# Altium schematic sheet Phase 4.SchDoc (part 4 of 4)
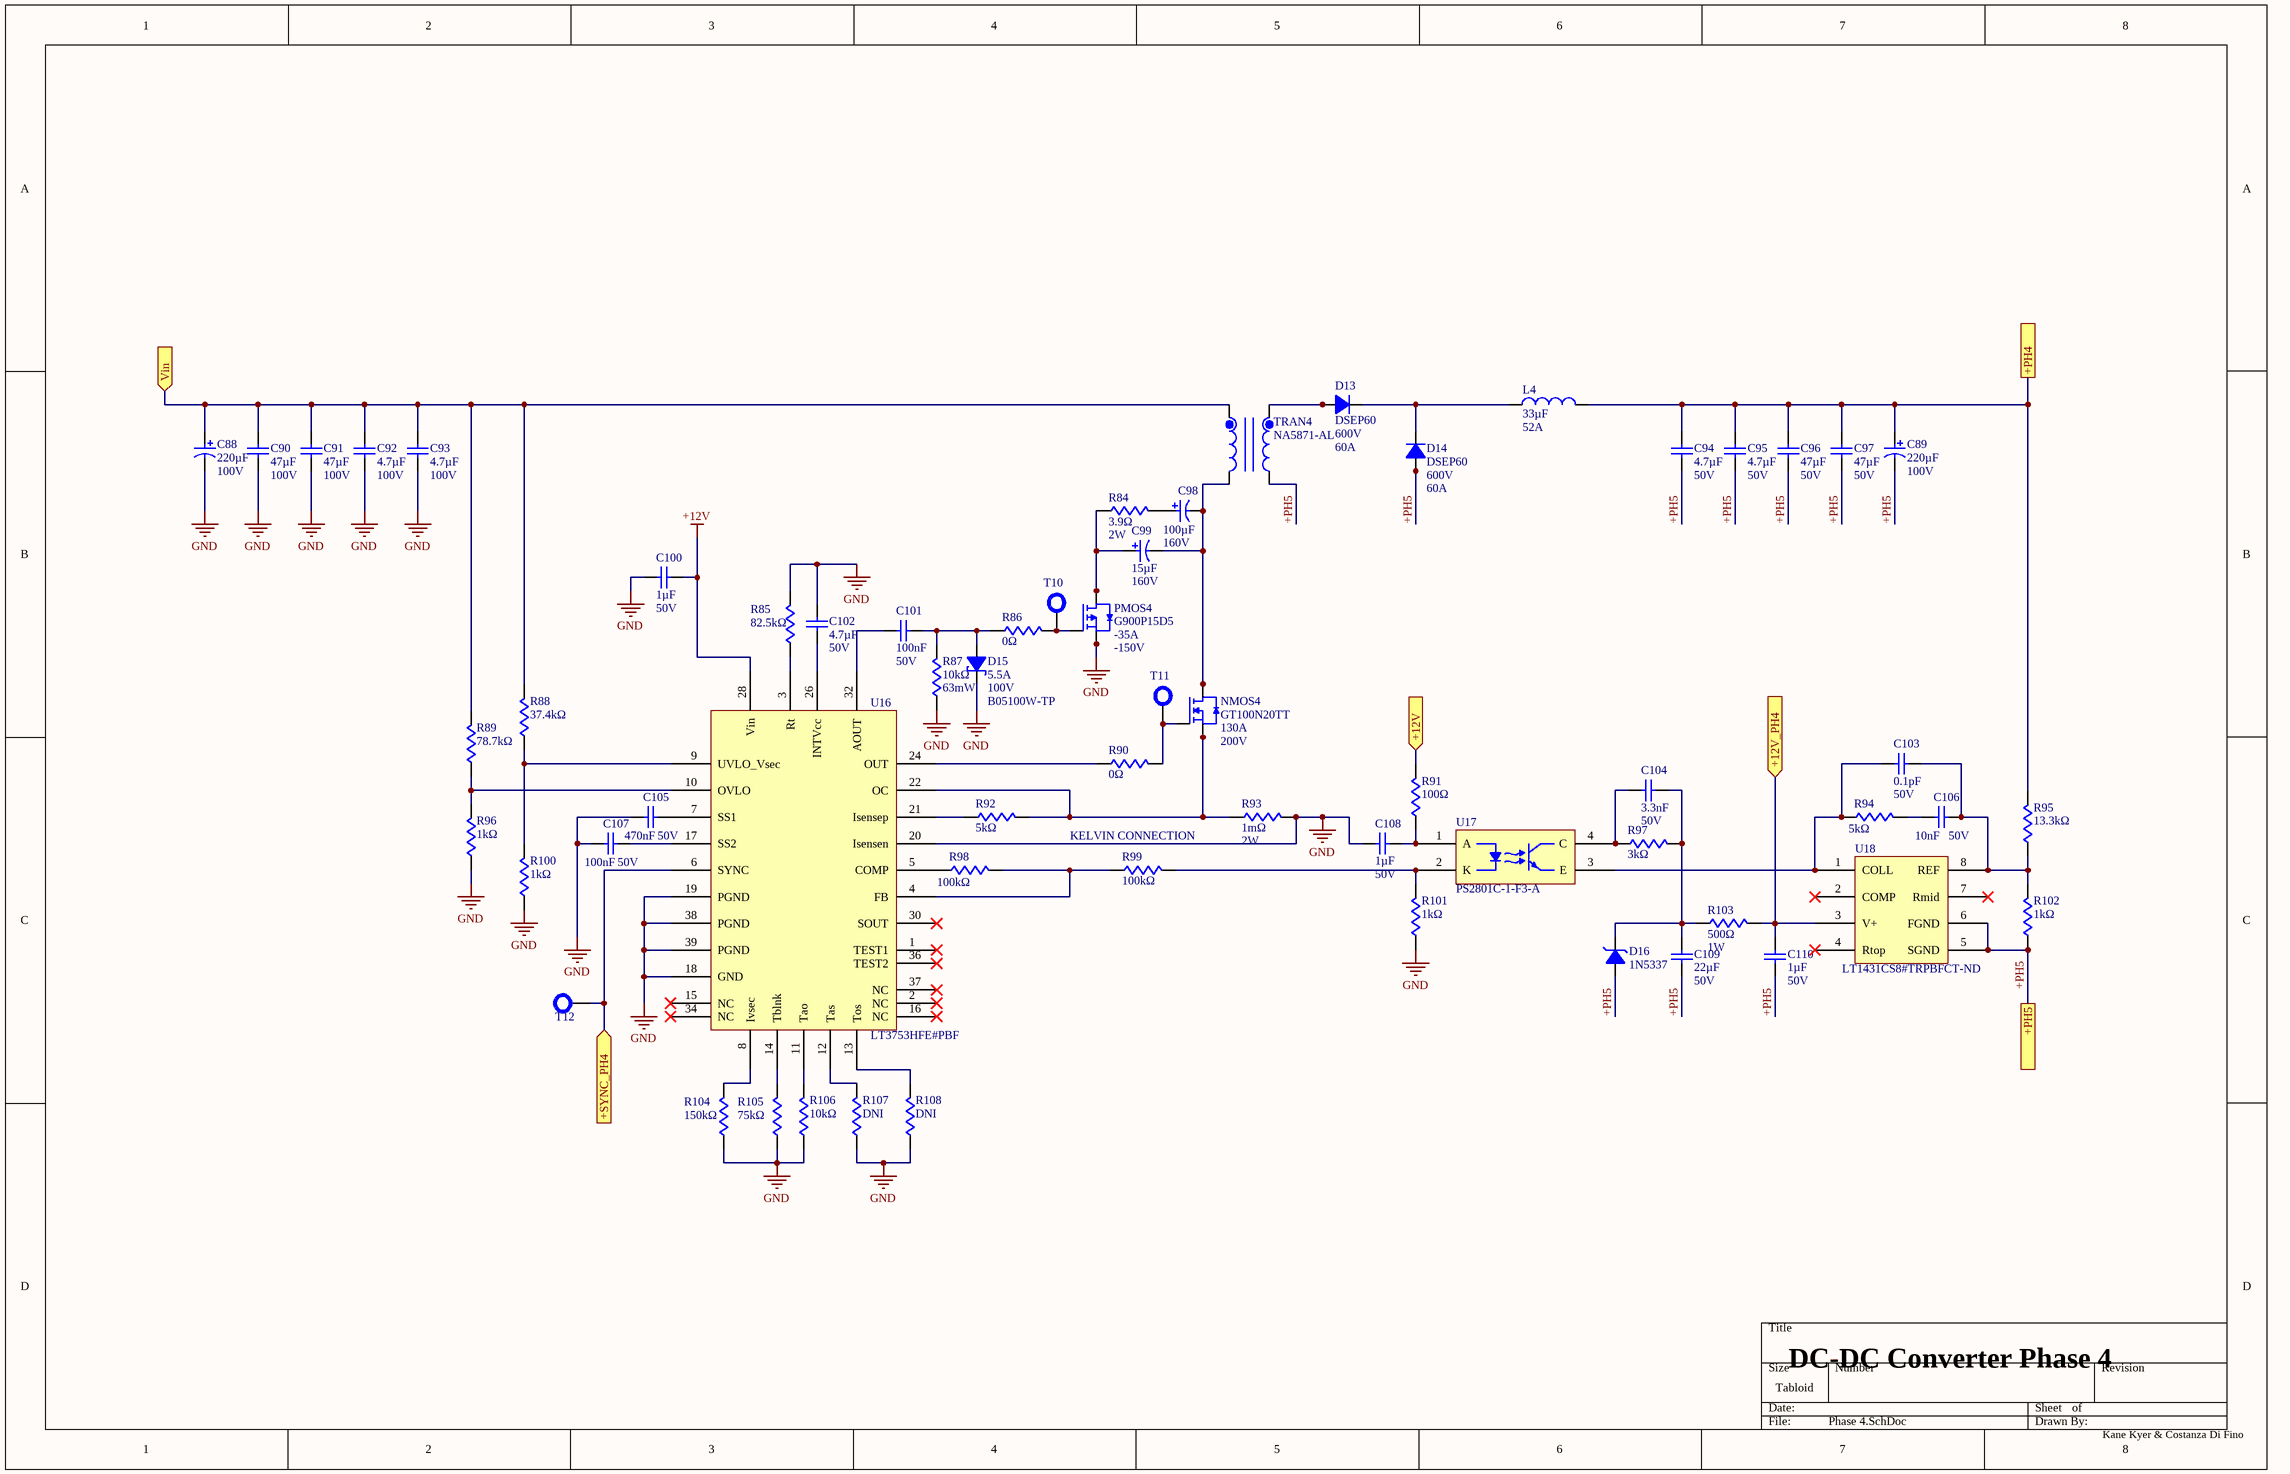
[diagram p3: Phase 4.SchDoc]

## Library data of the parts (continued)
U16 = LT3753HFE#PBF: 500kHz 8.5V~100V Buck-boost type 1 TSSOP-38-EP-4.4mm DC-DC Controllers ROHS; Manufacturer: Analog Devices; Manufacturer Lifecycle Status: PRODUCTION; Clock Sync: Yes; Max Supply Voltage: 100V; Min Supply Voltage: 8.5V; Nominal Supply Voltage: 12V; Number of Output Phases: 1; Topology: Forward Converter; Supplier: DigiKey; Supplier Part Number: LT3753HFE#PBF-ND; Manufacturer Part Number: LT3753HFE#PBF; RoHS: Compliant; Category: Power Management ICs; Stock: 4347; Pricing: 1=10.29, 10=8.033, 50=7.1302, 100=6.8507, 250=6.55552, 500=6.37764, 1000=6.23122 (USD); Case/Package: TSSOP; Frequency: 500kHz; Lifecycle Status: Production; Max Operating Temperature: 150°C; Min Operating Temperature: -40°C; Number of Outputs: 1; Pins: 31; Packaging: Cut Tape; REACH SVHC: No; Switching Frequency: 500kHz; Synchronous Rectifier: Yes; ComponentLink1URL: https://octopart.com:443/opatz8j6/c1?t=AFQ9J6M0bIKkv6plnB5aAB0RnePbyXhKQsa9pPFhZHIxlwYjryM3wnKOLEsPVrUAb0uXBMlzA3tjB-ejWwJKA7_cYNCdDBFeGPchwLcL7lXLjnUlKv0pBKfNuCEAZb8jTxRmFbxH9_jiNX6SVIrk2iwMUDb85Rbf6FC_21WJLsegI-Zm9eDxKUbvdxMUJlwEOrU3PsP6IHDcoU8HT-gJ-IT5i33qvtZm8K-bNX2Lqntbu9Y54Ggik3dFc7AlQv41q86evmeQPql3FfxnQIXi9zZ77tUgOd_x3vIhB6dB6_NjHFvgfISRLA&src-supplier=Analog+Devices; ComponentLink1Description: https://octopart.com:443/opatz8j6/c1?t=AFQ9J6M0bIKkv6plnB5aAB0RnePbyXhKQsa9pPFhZHIxlwYjryM3wnKOLEsPVrUAb0uXBMlzA3tjB-ejWwJKA7_cYNCdDBFeGPchwLcL7lXLjnUlKv0pBKfNuCEAZb8jTxRmFbxH9_jiNX6SVIrk2iwMUDb85Rbf6FC_21WJLsegI-Zm9eDxKUbvdxMUJlwEOrU3PsP6IHDcoU8HT-gJ-IT5i33qvtZm8K-bNX2Lqntbu9Y54Ggik3dFc7AlQv41q86evmeQPql3FfxnQIXi9zZ77tUgOd_x3vIhB6dB6_NjHFvgfISRLA&src-supplier=Analog+Devices; ComponentLink2URL: https://datasheet.octopart.com:443/LT3753HFE%23PBF-Analog-Devices-datasheet-48576317.pdf?src-supplier=Farnell; ComponentLink2Description: https://datasheet.octopart.com:443/LT3753HFE%23PBF-Analog-Devices-datasheet-48576317.pdf?src-supplier=Farnell; ComponentLink3URL: https://datasheet.octopart.com:443/LT3753HFE%23PBF-Linear-Technology-datasheet-27844002.pdf?src-supplier=Newark; ComponentLink3Description: https://datasheet.octopart.com:443/LT3753HFE%23PBF-Linear-Technology-datasheet-27844002.pdf?src-supplier=Newark; ComponentLink4URL: https://sigma.octopart.com:443/57697520/technical_drawing/Linear-Technology-LT3753HFE%23PBF.pdf?src-supplier=Linear+Technology; ComponentLink4Description: https://sigma.octopart.com:443/57697520/technical_drawing/Linear-Technology-LT3753HFE%23PBF.pdf?src-supplier=Linear+Technology; ComponentLink5URL: http://sigma.octopart.com:80/conflict_mineral_statement/Analog-Devices-company-33.pdf?src-supplier=Compliance+Statements; ComponentLink5Description: http://sigma.octopart.com:80/conflict_mineral_statement/Analog-Devices-company-33.pdf?src-supplier=Compliance+Statements; ComponentLink6URL: https://octopart.com:443/opatz8j6/c1?t=KpEjZENBkZ1-NUw-HjtedR9eLFJgymQ7GAK9rV5XKw3SqyDfJALBEApSMAE4CIdvoIQE0qP2K0XqaVt1GtZBag8rPx6zoXdBMr-uXqEdbgEjspU48heZgw1UTAaO9ifIt2F3aJLStdwEWxdJfmrN_EKcrP--VivhMJ7qdoeOV73bwFAQ1EnOK3cSuydEiXau78N9Bo3Gx89sRxnpMKkn9KAIUgYVAzwMH423vtfKzU2i8agEMc24Yn4z-4hMRrlXjpe_N-iOuMEGnC_qTiMDsYzo8HjdXEF1YpfTJcfYnFjkdZay3x1sag&src-supplier=Compliance+Statements; ComponentLink6Description: https://octopart.com:443/opatz8j6/c1?t=KpEjZENBkZ1-NUw-HjtedR9eLFJgymQ7GAK9rV5XKw3SqyDfJALBEApSMAE4CIdvoIQE0qP2K0XqaVt1GtZBag8rPx6zoXdBMr-uXqEdbgEjspU48heZgw1UTAaO9ifIt2F3aJLStdwEWxdJfmrN_EKcrP--VivhMJ7qdoeOV73bwFAQ1EnOK3cSuydEiXau78N9Bo3Gx89sRxnpMKkn9KAIUgYVAzwMH423vtfKzU2i8agEMc24Yn4z-4hMRrlXjpe_N-iOuMEGnC_qTiMDsYzo8HjdXEF1YpfTJcfYnFjkdZay3x1sag&src-supplier=Compliance+Statements
U17 = PS2801C-1-F3-A: Optocoupler DC-IN 1-CH Transistor DC-OUT 4-Pin SSOP T/R; Manufacturer: Renesas; Manufacturer Lifecycle Status: ACTIVE; Collector Emitter Breakdown Voltage: 80V; Collector Emitter Saturation Voltage: 300mV; Current Transfer Ratio: 50%; Dark Current: 100nA; Forward Current: 30mA; Forward Voltage: 1.4V; Input Current: 5mA; Isolation Voltage: 2.5kV; Max Power Dissipation: 120mW; Number of Elements: 1; Reverse Breakdown Voltage: 6V; Target Application: PLC\, Hybrid IC\, Power supply\, OA\, Measuring instrument\, Modem\, Communication devices; Supplier: DigiKey; RoHS: Compliant; Category: Optocouplers; Stock: 8089; Pricing: 1=0.85, 10=0.594, 100=0.436, 500=0.3653, 1000=0.34213 (USD); Case/Package: SSOP; China RoHS: Compliant; Collector Emitter Voltage (VCEO): 80V; Contact Plating: Tin Bismuth; Export Control Classification Number (ECCN) Code: EAR99; Part Family: PS2801C-1; Height: 2.1mm; Harmonized Tariff Schedule (HTS) Code: 8541.49.8000; Lifecycle Status: Production; Max Operating Temperature: 100°C; Min Operating Temperature: -55°C; MSL: 1; Mounting Technology: Surface Mount; Pins: 4; Output Voltage: 80V; Packaging: Cut Tape; REACH SVHC: Yes; ComponentLink1URL: https://datasheet.octopart.com:443/PS2801C-1-F3-A-Renesas-datasheet-179197394.pdf?src-supplier=Integrated+Device+Technology; ComponentLink1Description: https://datasheet.octopart.com:443/PS2801C-1-F3-A-Renesas-datasheet-179197394.pdf?src-supplier=Integrated+Device+Technology; ComponentLink2URL: https://datasheet.octopart.com:443/PS2801C-1-F3-A-Renesas-datasheet-150850810.pdf?src-supplier=Integrated+Device+Technology; ComponentLink2Description: https://datasheet.octopart.com:443/PS2801C-1-F3-A-Renesas-datasheet-150850810.pdf?src-supplier=Integrated+Device+Technology; ComponentLink3URL: https://datasheet.octopart.com:443/PS2801C-1-F3-A-Integrated-Device-Technology-datasheet-149188203.pdf?src-supplier=Integrated+Device+Technology; ComponentLink3Description: https://datasheet.octopart.com:443/PS2801C-1-F3-A-Integrated-Device-Technology-datasheet-149188203.pdf?src-supplier=Integrated+Device+Technology; ComponentLink4URL: https://datasheet.octopart.com:443/PS2801C-1-F3-A-Renesas-datasheet-181196928.pdf?src-supplier=IHS; ComponentLink4Description: https://datasheet.octopart.com:443/PS2801C-1-F3-A-Renesas-datasheet-181196928.pdf?src-supplier=IHS; ComponentLink5URL: https://datasheet.octopart.com:443/PS2801C-1-F3-A-NEC-datasheet-180895691.pdf?src-supplier=IHS; ComponentLink5Description: https://datasheet.octopart.com:443/PS2801C-1-F3-A-NEC-datasheet-180895691.pdf?src-supplier=IHS; ComponentLink6URL: https://datasheet.octopart.com:443/PS2801C-1-F3-A-Renesas-datasheet-138175760.pdf?src-supplier=Renesas; ComponentLink6Description: https://datasheet.octopart.com:443/PS2801C-1-F3-A-Renesas-datasheet-138175760.pdf?src-supplier=Renesas; ComponentLink7URL: https://datasheet.octopart.com:443/PS2801C-1-F3-A-Renesas-datasheet-5346041.pdf?src-supplier=element14+APAC; ComponentLink7Description: https://datasheet.octopart.com:443/PS2801C-1-F3-A-Renesas-datasheet-5346041.pdf?src-supplier=element14+APAC; ComponentLink8URL: https://datasheet.octopart.com:443/PS2801C-1-F3-A-Renesas-datasheet-136880012.pdf?src-supplier=Future+Electronics; ComponentLink8Description: https://datasheet.octopart.com:443/PS2801C-1-F3-A-Renesas-datasheet-136880012.pdf?src-supplier=Future+Electronics; ComponentLink9URL: http://sigma.octopart.com:80/reach_statement/Renesas-company-45.pdf?src-supplier=Compliance+Statements; ComponentLink9Description: http://sigma.octopart.com:80/reach_statement/Renesas-company-45.pdf?src-supplier=Compliance+Statements; ComponentLink10URL: http://sigma.octopart.com:80/conflict_mineral_statement/Renesas-company-44.pdf?src-supplier=Compliance+Statements; ComponentLink10Description: http://sigma.octopart.com:80/conflict_mineral_statement/Renesas-company-44.pdf?src-supplier=Compliance+Statements; Supplier Part Number: 559-1038-1-ND; Manufacturer Part Number: PS2801C-1-F3-A
U18 = LT1431CS8#TRPBF: V-Ref Adjustable 2.5V to 36V 100mA 8-Pin SOIC N T/R; Manufacturer: Analog Devices; Manufacturer Lifecycle Status: PRODUCTION; Cathode Current: 1mA; Reference Type: Shunt; Temperature Coefficient: 30ppm/°C; Tolerance: 0.4%; Supplier: DigiKey; Manufacturer Part Number: LT1431CS8#TRPBF; RoHS: Compliant; Category: Voltage References; Stock: 6692; Pricing: 1=4.76, 10=3.623, 25=3.3384, 100=3.025, 250=2.9682 (USD); Lead Free: Lead Free; Lifecycle Status: Production; Max Operating Temperature: 70°C; Max Output Voltage: 36V; Min Operating Temperature: 0°C; Min Output Voltage: 2.5V; Mounting Technology: Surface Mount; Pins: 8; Output Current: 100mA; Output Type: Adjustable; ComponentLink1URL: https://octopart.com:443/opatz8j6/c1?t=niELlFxzDfi0yCwovPYUCPkFv5h4fu5j3fc6Y_JWgZS-KG3gguwV1nhos1IG-X0q8FOT95_5suT6z4bIqEEHZa5Cr0Tl4wX-4Gea3le2l_P5Btni36aNB0VKN1eACfVw6XjlixpjNPZ2EoCnIZsmdjVtLb4T5dOKJqdmaG9p1s8rLUbRPnop80aw4yYD8dobzP2rtKjoPZxkMFX7s_x1MbrDISVlTufhy0OqU5fodmlGcRlmdB2uK6Q8wi9wAMnylkp3u30aJUXp9y1pTV4VT8brQ8AQsJucKiRghXvlz7QI_mNVRP68og&src-supplier=Analog+Devices; ComponentLink1Description: https://octopart.com:443/opatz8j6/c1?t=niELlFxzDfi0yCwovPYUCPkFv5h4fu5j3fc6Y_JWgZS-KG3gguwV1nhos1IG-X0q8FOT95_5suT6z4bIqEEHZa5Cr0Tl4wX-4Gea3le2l_P5Btni36aNB0VKN1eACfVw6XjlixpjNPZ2EoCnIZsmdjVtLb4T5dOKJqdmaG9p1s8rLUbRPnop80aw4yYD8dobzP2rtKjoPZxkMFX7s_x1MbrDISVlTufhy0OqU5fodmlGcRlmdB2uK6Q8wi9wAMnylkp3u30aJUXp9y1pTV4VT8brQ8AQsJucKiRghXvlz7QI_mNVRP68og&src-supplier=Analog+Devices; ComponentLink2URL: https://datasheet.octopart.com:443/LT1431CS8%23TRPBF-Analog-Devices-datasheet-158590489.pdf?src-supplier=Augswan; ComponentLink2Description: https://datasheet.octopart.com:443/LT1431CS8%23TRPBF-Analog-Devices-datasheet-158590489.pdf?src-supplier=Augswan; ComponentLink3URL: https://sigma.octopart.com:443/57689574/technical_drawing/Linear-Technology-LT1431CS8%23TRPBF.pdf?src-supplier=Linear+Technology; ComponentLink3Description: https://sigma.octopart.com:443/57689574/technical_drawing/Linear-Technology-LT1431CS8%23TRPBF.pdf?src-supplier=Linear+Technology; ComponentLink4URL: https://datasheet.octopart.com:443/LT1431CS8%23TRPBF-Linear-Technology-datasheet-12663249.pdf?src-supplier=Linear+Technology; ComponentLink4Description: https://datasheet.octopart.com:443/LT1431CS8%23TRPBF-Linear-Technology-datasheet-12663249.pdf?src-supplier=Linear+Technology; ComponentLink5URL: https://datasheet.octopart.com:443/LT1431CS8%23TRPBF-Linear-Technology-datasheet-14162000.pdf?src-supplier=iiiC; ComponentLink5Description: https://datasheet.octopart.com:443/LT1431CS8%23TRPBF-Linear-Technology-datasheet-14162000.pdf?src-supplier=iiiC; ComponentLink6URL: https://datasheet.octopart.com:443/LT1431CS8%23TRPBF-Linear-Technology-datasheet-660441.pdf?src-supplier=Component+Distributors+Inc.; ComponentLink6Description: https://datasheet.octopart.com:443/LT1431CS8%23TRPBF-Linear-Technology-datasheet-660441.pdf?src-supplier=Component+Distributors+Inc.; ComponentLink7URL: http://sigma.octopart.com:80/conflict_mineral_statement/Analog-Devices-company-33.pdf?src-supplier=Compliance+Statements; ComponentLink7Description: http://sigma.octopart.com:80/conflict_mineral_statement/Analog-Devices-company-33.pdf?src-supplier=Compliance+Statements; ComponentLink8URL: https://octopart.com:443/opatz8j6/c1?t=x_UgC8z0ZW9HVBYfWtRK1MQXyidqPpcSjAfueHo9YnawvAkFl5SvDyGxYSqo2jvWZKzVJDVTRvwyt6-9bSOmk9hm3rvBRrSJoViBsOBz-zaTqDQ1UuTon1oynDbAG1BJ8LFFGJ-pvHqqe_ahwIPaiUAyxwKDpl_WDXhLfkPwU4s3DC4oM42DqSA56VDCGnGZU0YdFavN5d4mf8bZyX9JjAzy5--p3JbOg0D6jqXi6c2GCo47z_BbYPuyEPlhjEKZPTviFMXkQtwuopNuNXSm1BD9XLOQFCoZDF8jjiZ5eNS4L1NzzTsuyw&src-supplier=Compliance+Statements; ComponentLink8Description: https://octopart.com:443/opatz8j6/c1?t=x_UgC8z0ZW9HVBYfWtRK1MQXyidqPpcSjAfueHo9YnawvAkFl5SvDyGxYSqo2jvWZKzVJDVTRvwyt6-9bSOmk9hm3rvBRrSJoViBsOBz-zaTqDQ1UuTon1oynDbAG1BJ8LFFGJ-pvHqqe_ahwIPaiUAyxwKDpl_WDXhLfkPwU4s3DC4oM42DqSA56VDCGnGZU0YdFavN5d4mf8bZyX9JjAzy5--p3JbOg0D6jqXi6c2GCo47z_BbYPuyEPlhjEKZPTviFMXkQtwuopNuNXSm1BD9XLOQFCoZDF8jjiZ5eNS4L1NzzTsuyw&src-supplier=Compliance+Statements